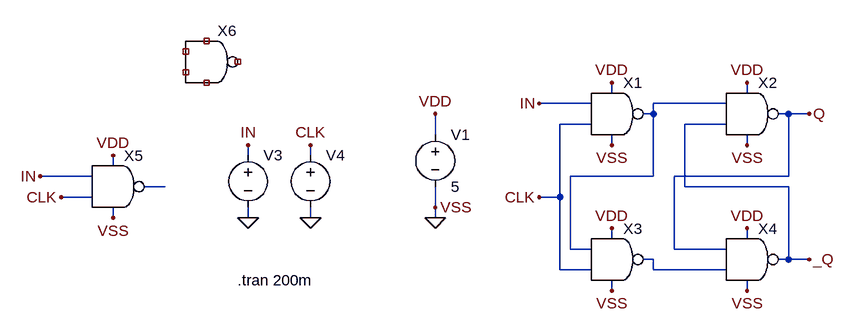
[diagram p0: schematic latchD.asc]
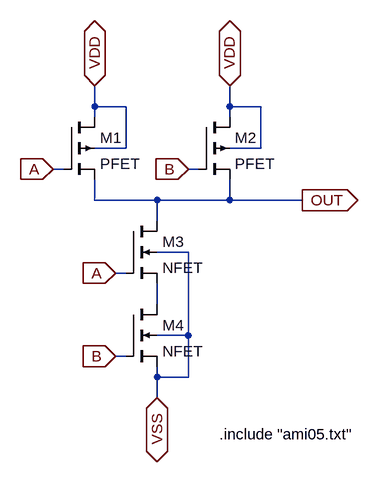
[diagram p1: sub-circuit nand2.asc]
latchD.asc, the LTspice schematic file:
Version 4
SHEET 1 880 680
WIRE 64 48 64 32
WIRE 272 48 272 32
WIRE 32 64 -48 64
WIRE 240 64 128 64
WIRE 128 80 128 64
WIRE 128 80 112 80
WIRE 336 80 320 80
WIRE 368 80 336 80
WIRE 32 96 -16 96
WIRE 240 96 176 96
WIRE -208 112 -208 80
WIRE 64 128 64 112
WIRE 272 128 272 112
WIRE -496 144 -496 128
WIRE -400 144 -400 128
WIRE -704 160 -704 144
WIRE -736 176 -816 176
WIRE 128 176 128 80
WIRE 128 176 0 176
WIRE 336 176 336 80
WIRE 336 176 160 176
WIRE -624 192 -656 192
WIRE 176 192 176 96
WIRE 336 192 176 192
WIRE -736 208 -784 208
WIRE -16 208 -16 96
WIRE -16 208 -48 208
WIRE -208 224 -208 192
WIRE -704 240 -704 224
WIRE -496 240 -496 224
WIRE -400 240 -400 224
WIRE -208 240 -208 224
WIRE 64 272 64 256
WIRE 272 272 272 256
WIRE 0 288 0 176
WIRE 32 288 0 288
WIRE 160 288 160 176
WIRE 240 288 160 288
WIRE 128 304 112 304
WIRE 336 304 336 192
WIRE 336 304 320 304
WIRE 368 304 336 304
WIRE -16 320 -16 208
WIRE 32 320 -16 320
WIRE 128 320 128 304
WIRE 240 320 128 320
WIRE 64 352 64 336
WIRE 272 352 272 336
FLAG 64 32 VDD
FLAG 64 128 VSS
FLAG 272 32 VDD
FLAG 272 128 VSS
FLAG 64 256 VDD
FLAG 64 352 VSS
FLAG 272 256 VDD
FLAG 272 352 VSS
FLAG -48 64 IN
FLAG -48 208 CLK
FLAG 368 80 Q
FLAG 368 304 _Q
FLAG -208 80 VDD
FLAG -496 240 0
FLAG -400 240 0
FLAG -496 128 IN
FLAG -400 128 CLK
FLAG -704 144 VDD
FLAG -704 240 VSS
FLAG -816 176 IN
FLAG -784 208 CLK
FLAG -208 240 0
FLAG -208 224 VSS
SYMBOL nand2 64 80 R0
SYMATTR InstName X1
SYMBOL nand2 272 80 R0
SYMATTR InstName X2
SYMBOL nand2 64 304 R0
SYMATTR InstName X3
SYMBOL nand2 272 304 R0
SYMATTR InstName X4
SYMBOL voltage -208 96 R0
SYMATTR InstName V1
SYMATTR Value 5
SYMBOL voltage -496 128 R0
WINDOW 3 24 96 Invisible 2
WINDOW 123 0 0 Left 0
WINDOW 39 0 0 Left 0
SYMATTR Value PULSE(0 5 0 10u 10u 100m 200m)
SYMATTR InstName V3
SYMBOL voltage -400 128 R0
WINDOW 3 24 96 Invisible 2
WINDOW 123 0 0 Left 0
WINDOW 39 0 0 Left 0
SYMATTR Value PULSE(0 5 0 10u 10u 50m 100m)
SYMATTR InstName V4
SYMBOL nand2 -704 192 R0
SYMATTR InstName X5
SYMBOL nand2 -560 0 R0
SYMATTR InstName X6
TEXT -512 336 Left 2 !.tran 200m

nand2.asc, the sub-circuit schematic file:
Version 4
SHEET 1 880 680
WIRE 240 0 240 -32
WIRE 288 0 240 0
WIRE 448 0 448 -32
WIRE 496 0 448 0
WIRE 240 16 240 0
WIRE 448 16 448 0
WIRE 288 64 288 0
WIRE 288 64 240 64
WIRE 496 64 496 0
WIRE 496 64 448 64
WIRE 192 96 176 96
WIRE 400 96 384 96
WIRE 240 144 240 112
WIRE 336 144 240 144
WIRE 448 144 448 112
WIRE 448 144 336 144
WIRE 560 144 448 144
WIRE 336 176 336 144
WIRE 384 224 336 224
WIRE 288 256 272 256
WIRE 336 304 336 272
WIRE 384 352 384 224
WIRE 384 352 336 352
WIRE 288 384 272 384
WIRE 336 416 336 400
WIRE 384 416 384 352
WIRE 384 416 336 416
WIRE 336 448 336 416
FLAG 336 448 VSS
IOPIN 336 448 BiDir
FLAG 448 -32 VDD
IOPIN 448 -32 BiDir
FLAG 240 -32 VDD
IOPIN 240 -32 BiDir
FLAG 384 96 B
IOPIN 384 96 In
FLAG 272 384 B
IOPIN 272 384 In
FLAG 272 256 A
IOPIN 272 256 In
FLAG 176 96 A
IOPIN 176 96 In
FLAG 560 144 OUT
IOPIN 560 144 Out
SYMBOL pmos4 192 16 R0
SYMATTR InstName M1
SYMATTR Value PFET
SYMATTR Value2 l=0.6u w=3u
SYMBOL pmos4 400 16 R0
SYMATTR InstName M2
SYMATTR Value PFET
SYMATTR Value2 l=0.6u w=3u
SYMBOL nmos4 288 176 R0
SYMATTR InstName M3
SYMATTR Value NFET
SYMATTR Value2 l=0.6u w=3u
SYMBOL nmos4 288 304 R0
SYMATTR InstName M4
SYMATTR Value NFET
SYMATTR Value2 l=0.6u w=3u
TEXT 432 504 Left 2 !.include "ami05.txt"

The netlist it stands for:
* latchD.asc
XX1 IN CLK N001 VDD 0 nand2
XX2 N001 _Q Q VDD 0 nand2
XX3 N001 CLK N003 VDD 0 nand2
XX4 Q N003 _Q VDD 0 nand2
V1 VDD 0 5
V3 IN 0 PULSE(0 5 0 10u 10u 100m 200m)
V4 CLK 0 PULSE(0 5 0 10u 10u 50m 100m)
XX5 IN CLK N002 VDD 0 nand2
XX6 NC_01 NC_02 NC_03 NC_04 NC_05 nand2

* block symbol definitions
.subckt nand2 A B OUT VDD VSS
M1 VDD A OUT VDD PFET l=0.6u w=3u
M2 VDD B OUT VDD PFET l=0.6u w=3u
M3 OUT A N001 VSS NFET l=0.6u w=3u
M4 N001 B VSS VSS NFET l=0.6u w=3u
.include "ami05.txt"
.ends nand2

.model NMOS NMOS
.model PMOS PMOS
.lib standard.mos
.tran 200m
.backanno
.end